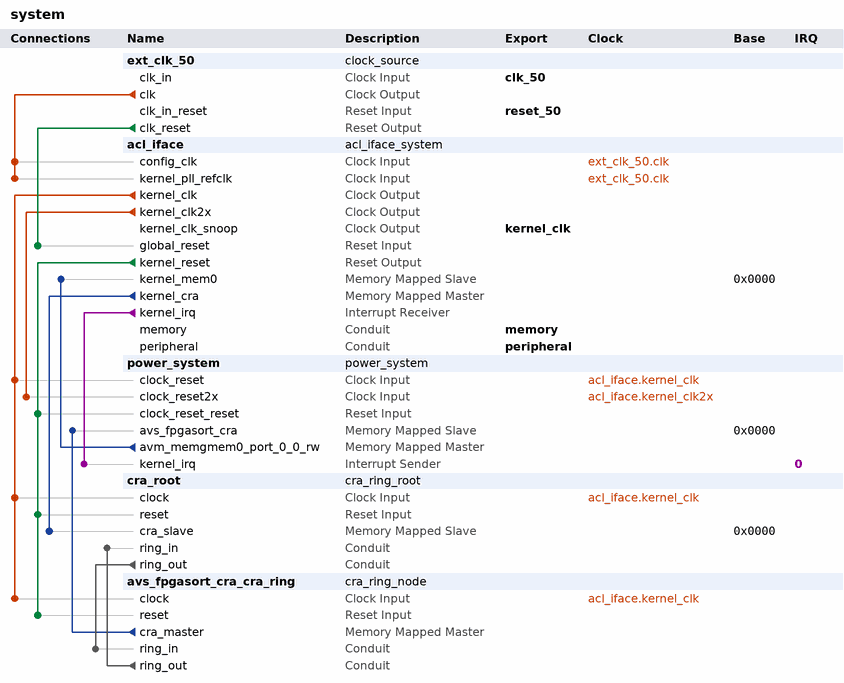
[diagram p0: system contents]
# Platform Designer (Qsys) system system, Cyclone V 5CSEMA5F31C6
# Parameters at their usual value, and those the tool derives, are not listed.
package require -exact qsys 14.0
create_system system
set_project_property DEVICE_FAMILY {Cyclone V}
set_project_property DEVICE 5CSEMA5F31C6

add_instance ext_clk_50 clock_source 14.0
set_instance_parameter_value ext_clk_50 clockFrequency 50000000

add_instance acl_iface acl_iface_system 1.0

add_instance power_system power_system 1.0

add_instance cra_root cra_ring_root 1.0
set_instance_parameter_value cra_root ADDR_W 5
set_instance_parameter_value cra_root DATA_W 64
set_instance_parameter_value cra_root ID_W 0

add_instance avs_fpgasort_cra_cra_ring cra_ring_node 1.0
set_instance_parameter_value avs_fpgasort_cra_cra_ring RING_ADDR_W 5
set_instance_parameter_value avs_fpgasort_cra_cra_ring CRA_ADDR_W 5
set_instance_parameter_value avs_fpgasort_cra_cra_ring DATA_W 64
set_instance_parameter_value avs_fpgasort_cra_cra_ring ID_W 0
set_instance_parameter_value avs_fpgasort_cra_cra_ring ID 0

# connections
add_connection acl_iface.kernel_clk avs_fpgasort_cra_cra_ring.clock clock
add_connection acl_iface.kernel_clk cra_root.clock clock
add_connection acl_iface.kernel_clk power_system.clock_reset clock
add_connection acl_iface.kernel_clk2x power_system.clock_reset2x clock
add_connection ext_clk_50.clk acl_iface.config_clk clock
add_connection ext_clk_50.clk acl_iface.kernel_pll_refclk clock
add_connection acl_iface.kernel_reset avs_fpgasort_cra_cra_ring.reset reset
add_connection acl_iface.kernel_reset cra_root.reset reset
add_connection acl_iface.kernel_reset power_system.clock_reset_reset reset
add_connection ext_clk_50.clk_reset acl_iface.global_reset reset
add_connection acl_iface.kernel_cra cra_root.cra_slave avalon
set_connection_parameter_value acl_iface.kernel_cra/cra_root.cra_slave baseAddress 0x0000
add_connection avs_fpgasort_cra_cra_ring.cra_master power_system.avs_fpgasort_cra avalon
set_connection_parameter_value avs_fpgasort_cra_cra_ring.cra_master/power_system.avs_fpgasort_cra baseAddress 0x0000
add_connection power_system.avm_memgmem0_port_0_0_rw acl_iface.kernel_mem0 avalon
set_connection_parameter_value power_system.avm_memgmem0_port_0_0_rw/acl_iface.kernel_mem0 baseAddress 0x0000
add_connection avs_fpgasort_cra_cra_ring.ring_out cra_root.ring_in conduit
add_connection cra_root.ring_out avs_fpgasort_cra_cra_ring.ring_in conduit
add_connection acl_iface.kernel_irq power_system.kernel_irq interrupt
set_connection_parameter_value acl_iface.kernel_irq/power_system.kernel_irq irqNumber 0

# exported interfaces
add_interface clk_50 clock sink
set_interface_property clk_50 EXPORT_OF ext_clk_50.clk_in
add_interface reset_50 reset sink
set_interface_property reset_50 EXPORT_OF ext_clk_50.clk_in_reset
add_interface kernel_clk clock source
set_interface_property kernel_clk EXPORT_OF acl_iface.kernel_clk_snoop
add_interface memory conduit end
set_interface_property memory EXPORT_OF acl_iface.memory
add_interface peripheral conduit end
set_interface_property peripheral EXPORT_OF acl_iface.peripheral

set_interconnect_requirement {$system} qsys_mm.clockCrossingAdapter FIFO
set_interconnect_requirement {$system} qsys_mm.maxAdditionalLatency 0

save_system system.qsys
